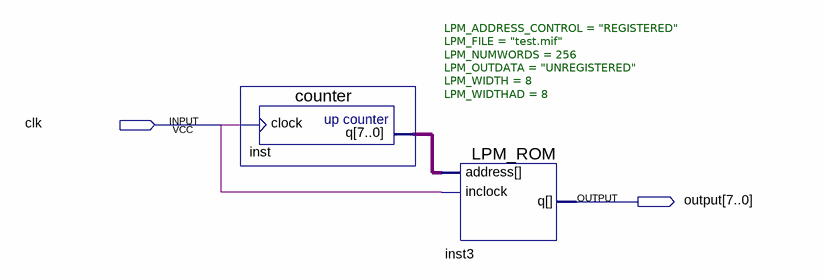
[diagram p0: schematic sheet]
// Quartus schematic test.bdf as structural Verilog: 2 symbols, 2 pins
module test (
  input  clk,
  output [7:0] \output 
);

  wire [7:0] inst_q;

  counter inst (.clock(clk), .q(inst_q));
  LPM_ROM #(.LPM_ADDRESS_CONTROL("REGISTERED"), .LPM_FILE("test.mif"), .LPM_NUMWORDS(256), .LPM_OUTDATA("UNREGISTERED"), .LPM_WIDTH(8), .LPM_WIDTHAD(8)) inst3 (
    .address(inst_q), .inclock(clk), .q(\output ));
endmodule
